# EAGLE design the-why (EAGLE 9.6.2)

## Sheet 1 of 2
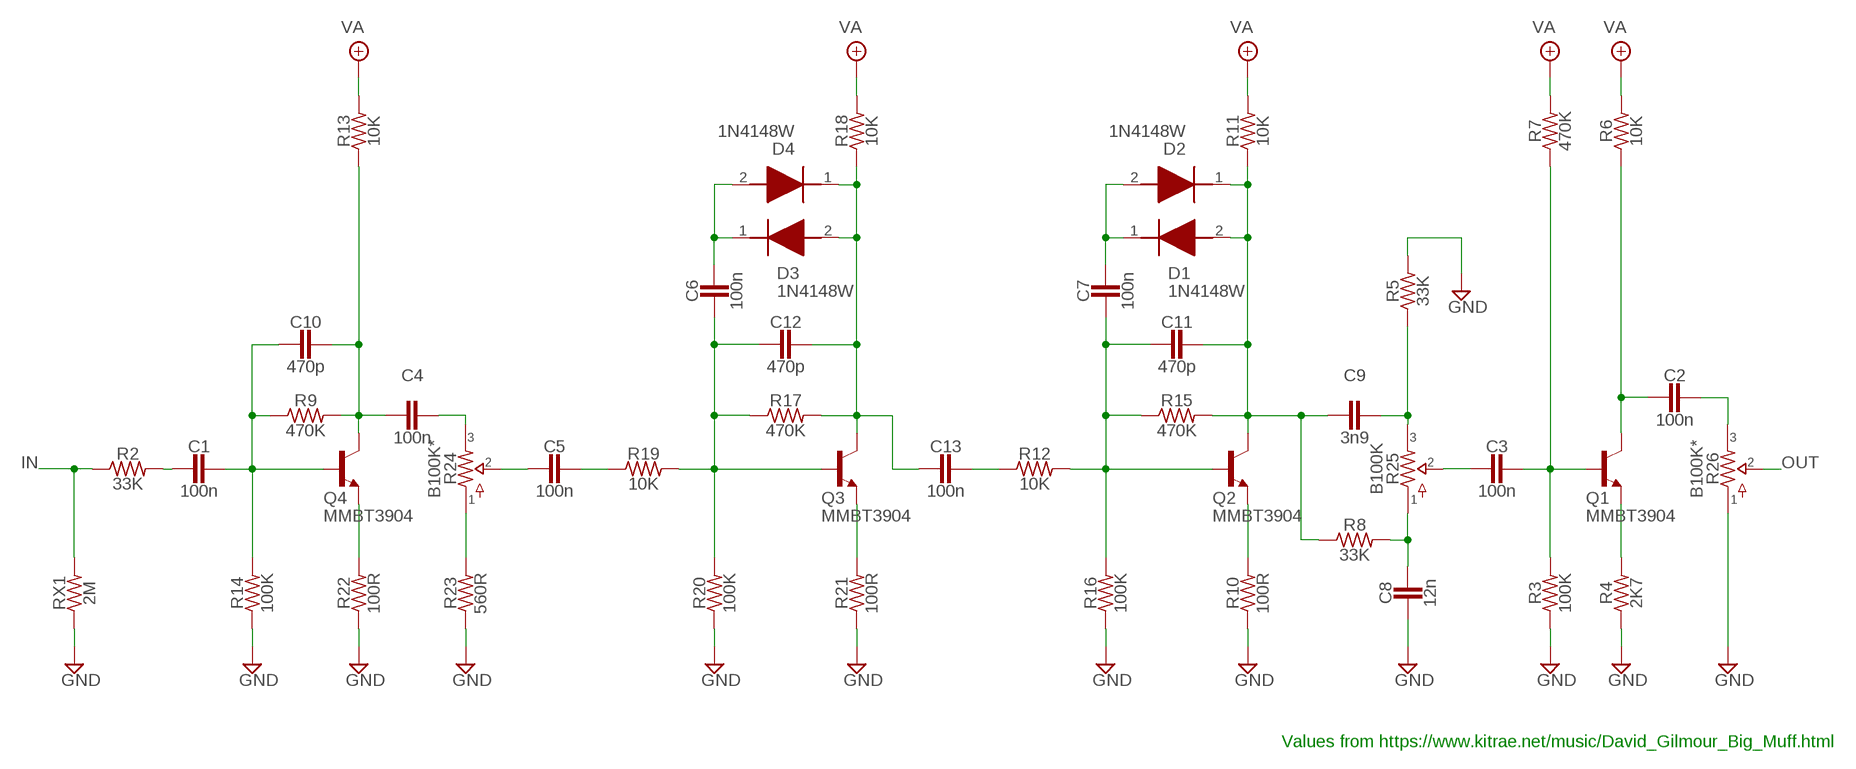
[diagram p0: schematic, sheet 1]

### Parts
C1  100n  CAP1206  [RESISTOR_C1206]
C2  100n  CAP1206  [RESISTOR_C1206]
C3  100n  CAP1206  [RESISTOR_C1206]
C4  100n  CAP1206  [RESISTOR_C1206]
C5  100n  CAP1206  [RESISTOR_C1206]
C6  100n  CAP1206  [RESISTOR_C1206]
C7  100n  CAP1206  [RESISTOR_C1206]
C8  12n  CAP0603  [RESISTOR_R0603]
C9  3n9  CAP1206  [RESISTOR_C1206]
C10  470p  CAP0603  [RESISTOR_R0603]
C11  470p  CAP0603  [RESISTOR_R0603]
C12  470p  CAP0603  [RESISTOR_R0603]
C13  100n  CAP1206  [RESISTOR_C1206]
D1  1N4148W  [SODFL3816X120N]
D2  1N4148W  [SODFL3816X120N]
D3  1N4148W  [SODFL3816X120N]
D4  1N4148W  [SODFL3816X120N]
Q1  MMBT3904  BJTSOT23  [TRANSISTOR_SOT23-BEC]
Q2  MMBT3904  BJTSOT23  [TRANSISTOR_SOT23-BEC]
Q3  MMBT3904  BJTSOT23  [TRANSISTOR_SOT23-BEC]
Q4  MMBT3904  BJTSOT23  [TRANSISTOR_SOT23-BEC]
R2  33K  RESISTOR0603  [RESISTOR_R0603]
R3  100K  RESISTOR0603  [RESISTOR_R0603]
R4  2K7  RESISTOR0603  [RESISTOR_R0603]
R5  33K  RESISTOR0603  [RESISTOR_R0603]
R6  10K  RESISTOR0603  [RESISTOR_R0603]
R7  470K  RESISTOR0603  [RESISTOR_R0603]
R8  33K  RESISTOR0603  [RESISTOR_R0603]
R9  470K  RESISTOR0603  [RESISTOR_R0603]
R10  100R  RESISTOR0603  [RESISTOR_R0603]
R11  10K  RESISTOR0603  [RESISTOR_R0603]
R12  10K  RESISTOR0603  [RESISTOR_R0603]
R13  10K  RESISTOR0603  [RESISTOR_R0603]
R14  100K  RESISTOR0603  [RESISTOR_R0603]
R15  470K  RESISTOR0603  [RESISTOR_R0603]
R16  100K  RESISTOR0603  [RESISTOR_R0603]
R17  470K  RESISTOR0603  [RESISTOR_R0603]
R18  10K  RESISTOR0603  [RESISTOR_R0603]
R19  10K  RESISTOR0603  [RESISTOR_R0603]
R20  100K  RESISTOR0603  [RESISTOR_R0603]
R21  100R  RESISTOR0603  [RESISTOR_R0603]
R22  100R  RESISTOR0603  [RESISTOR_R0603]
R23  560R  RESISTOR0603  [RESISTOR_R0603]
R24  B100K*  16MM.1  [16MM_B.MOUNT]
R25  B100K  16MM.1  [16MM_B.MOUNT]
R26  B100K*  16MM.1  [16MM_B.MOUNT]
RX1  2M  RESISTOR0603  [RESISTOR_R0603]

### Nets
GND: C8.2 R3.1 R4.1 R5.2 R10.1 R14.1 R16.1 R20.1 R21.1 R22.1 R23.1 R26.1 RX1.1 ; also sheet 2
IN: R2.1 RX1.2 ; also sheet 2
N$1: C1.2 R2.2
N$2: C1.1 C10.2 Q4.B R9.1 R14.2
N$3: C4.2 C10.1 Q4.C R9.2 R13.1
N$4: Q4.E R22.2
N$5: C4.1 R24.3
N$6: R23.2 R24.1
N$7: C5.2 R24.2
N$8: C5.1 R19.1
N$9: C6.2 C12.2 Q3.B R17.1 R19.2 R20.2
N$11: C6.1 D3.1(K) D4.2(A)
N$12: Q3.E R21.2
N$13: C9.1 R5.1 R25.3
N$14: C13.1 R12.1
N$15: C7.2 C11.2 Q2.B R12.2 R15.1 R16.2
N$17: Q2.E R10.2
N$18: C7.1 D1.1(K) D2.2(A)
N$19: C8.1 R8.2 R25.1
N$20: C3.2 R25.2
N$21: C3.1 Q1.B R3.2 R7.1
N$22: Q1.E R4.2
N$23: C2.2 Q1.C R6.1
N$24: C2.1 R26.3
N$28: C12.1 C13.2 D3.2(A) D4.1(K) Q3.C R17.2 R18.1
N$29: C9.2 C11.1 D1.2(A) D2.1(K) Q2.C R8.1 R11.1 R15.2
OUT: R26.2 ; also sheet 2
VA: R6.2 R7.2 R11.2 R13.2 R18.2 ; also sheet 2

### Notes on the sheet
- Values from https://www.kitrae.net/music/David_Gilmour_Big_Muff.html

## Sheet 2 of 2
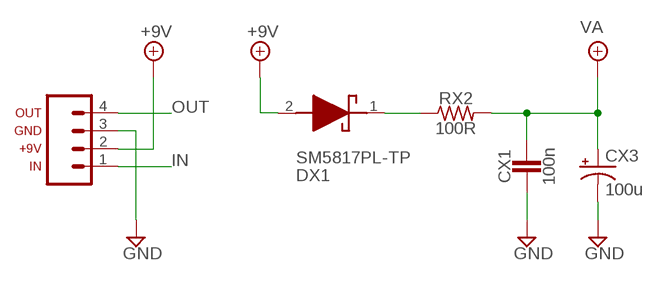
[diagram p1: schematic, sheet 2]

### Parts
CX1  100n  CAP0603  [RESISTOR_R0603]
CX3  100u  0631  [063_025]
DX1  SM5817PL-TP  [SOD3716X120N]
J101  1X04_SMD_STRAIGHT_COMBO  CONN_04PTH  [1X04]
RX2  100R  RESISTOR0603  [RESISTOR_R0603]

### Nets
+9V: DX1.2(A) J101.2(+9V)
GND: CX1.2 CX3.- J101.3(GND) ; also sheet 1
IN: J101.1(IN) ; also sheet 1
N$25: DX1.1(K) RX2.1
OUT: J101.4(OUT) ; also sheet 1
VA: CX1.1 CX3.+ RX2.2 ; also sheet 1

## Library data of the parts
C1-C13 CX1 = the-why:CAP
CX3 = the-why:063: 33 - 220uF Xicon values at Mouser.com 10V: 220uF; 16V: 100uF; 25V: 100uF; 50V: 33uF
D1-D4 = the-why:1N4148W: Rectifier Diode Small Signal Switching 100V 0.15A 4ns 2-Pin SOD-123F T/R Source: Datasheet <https://diotec.com/request/datasheet/1n4148w.pdf>; DESCRIPTION: Rectifier Diode Small Signal Switching 100V 0.15A 4ns 2-Pin SOD-123F T/R; HEIGHT: 1.2mm; MANUFACTURER_NAME: Diotec; MANUFACTURER_PART_NUMBER: 1N4148W; MOUSER_PART_NUMBER: 637-1N4148W; MOUSER_PRICE-STOCK: https://www.mouser.co.uk/ProductDetail/Diotec-Semiconductor/1N4148W?qs=OlC7AqGiEDmsbkbAeXQtXg%3D%3D
DX1 = the-why:SM5817PL-TP: Schottky Barrier Rectifiers Source: Datasheet <https://mccsemi.com/pdf/Products/SM5817PL-SM5819PL(SOD-123FL).pdf>; DESCRIPTION: Schottky Barrier Rectifiers; HEIGHT: 1.2mm; MANUFACTURER_NAME: MCC; MANUFACTURER_PART_NUMBER: SM5817PL-TP; MOUSER_PART_NUMBER: 833-SM5817PL-TP; MOUSER_PRICE-STOCK: https://www.mouser.co.uk/ProductDetail/Micro-Commercial-Components-MCC/SM5817PL-TP?qs=SdqRYZZ9IxAlhPsFLNd53A%3D%3D
J101 = the-why:CONN_04: Multi connection point. Often used as Generic Header-pin footprint for 0.1 inch spaced/style header connections On any of the 0.1 inch spaced packages, you can populate with these: Break Away Headers - Straight <https://www.sparkfun.com/products/116> (PRT-00116) Break Away Male Headers - Right Angle <https://www.sparkfun.com/products/553> (PRT-00553) Female Headers <https://www.sparkfun.com/products/115> (PRT-00115) Break Away Headers - Machine Pin <https://www.sparkfun.com/products/117> (PRT-00117) Break Away Female Headers - Swiss Machine Pin <https://www.sparkfun.com/products/743> (PRT-00743) For SCREWTERMINALS and SPRING TERMINALS visit here: Screw Terimnals on SparkFun.com <https://www.sparkfun.com/search/results?term=Screw+Terminals> (5mm/3.5mm/2.54mm spacing) This device is also useful as a general connection point to wire up your design to another part of your project. Our various solder wires solder well into these plated through hole pads. Hook-Up Wire - Assortment (Stranded, 22 AWG) <https://www.sparkfun.com/products/11375> (PRT-11375) Hook-Up Wire - Assortment (Solid Core, 22 AWG) <https://www.sparkfun.com/products/11367> (PRT-11367) View the entire wire category on our website here <https://www.sparkfun.com/categories/141> Special notes: Molex polarized connector foot print use with SKU : PRT-08231 with associated crimp pins and housings. 1MM SMD Version SKU: PRT-10208; PROD_ID: CONN-14363; SF_ID: PRT-08075; STOREFRONT_SKU: PRT-15900
Q1-Q4 = the-why:BJT
R2-R23 RX1 RX2 = the-why:RESISTOR
R24-R26 = the-why:16MM: 16mm Poteniometers

## Board
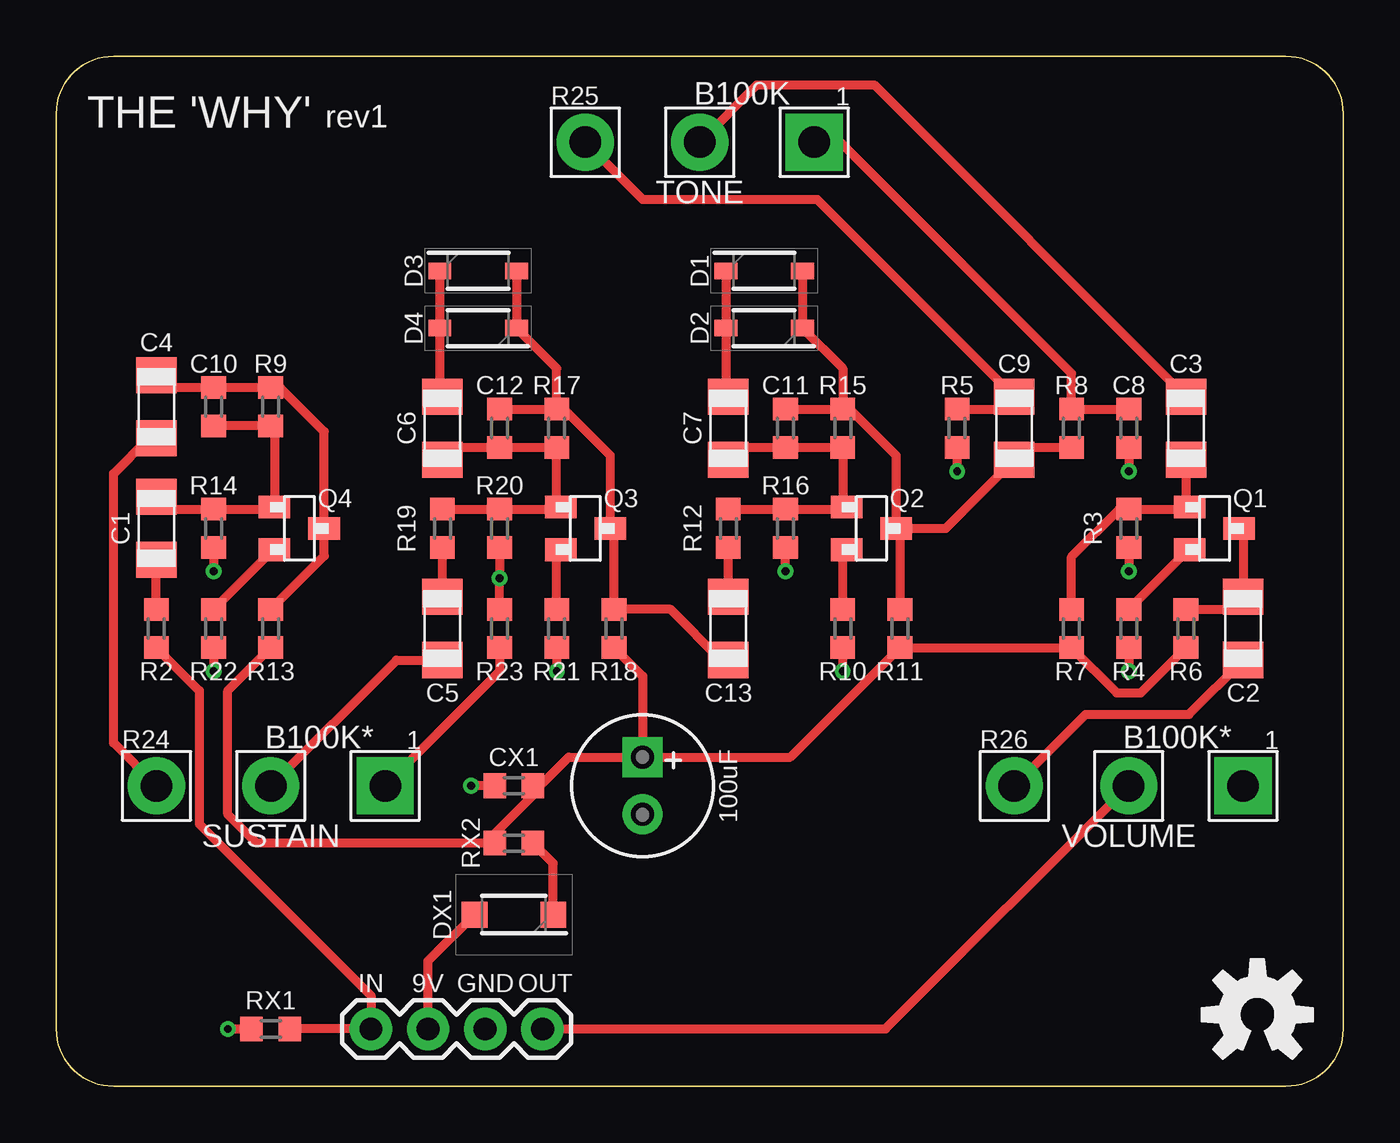
[diagram p2: board, top side]
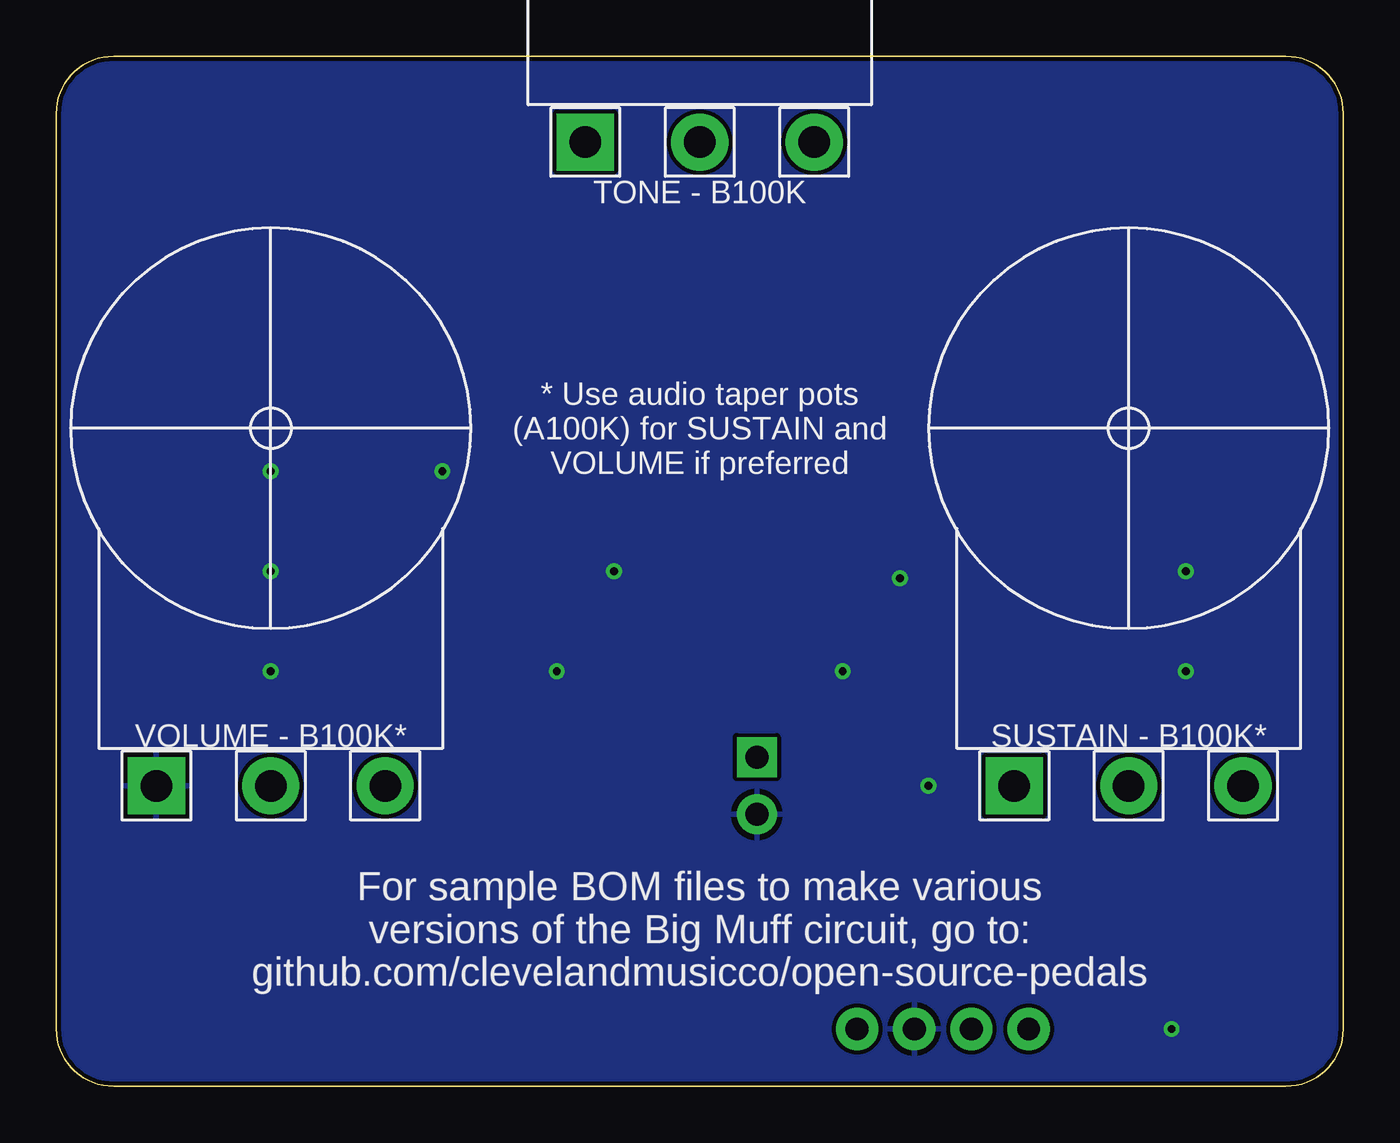
[diagram p3: board, bottom side, seen from below]

Size 57.15 x 45.72 mm. Coordinates in mm from the lower left corner, seen from the top.
Outline: 0,2.54 0,43.18 arc-90 2.54,45.72 54.61,45.72 arc-90 57.15,43.18 57.15,2.54 arc-90 54.61,0 2.54,0 arc-90 0,2.54
Copper layers (1*16): Top 0.035mm / dielectric 1.5mm / Bottom 0.035mm
Design rules "SparkFun-2-Layer-General-JLCPCB": minimum track width 7mil, minimum drill 0.3mm, track to track 7mil, track to pad 7mil, pad to pad 7mil, via to via 7mil, smd to smd 7mil, copper to edge 7mil, drill to drill 7mil, minimum pad ring 7mil, minimum via ring 7mil, stop-mask expansion 3mil, vias tented up to drill 25mil, thermal gap 10mil

### Footprints (pad centres in the part's own frame; a part is rotated, then mirrored left to right if it is on the bottom)
RESISTOR_C1206 = smd 1.6 x 1.8: 1 -1.4,0; 2 1.4,0
RESISTOR_R0603 = smd 1 x 1.1: 1 -0.85,0; 2 0.85,0
063_025 = drill 1.016 pad 1.778 square: + -1.27,0 | drill 1.016 pad 1.778: - 1.27,0
SODFL3816X120N = smd 1.02 x 0.74: 1 -1.7,0; 2 1.7,0
SOD3716X120N = smd 1.15 x 1.15: 1 -1.75,0; 2 1.75,0
1X04 = drill 1.016 pad 1.88: 1 0,0; 2 2.54,0; 3 5.08,0; 4 7.62,0
TRANSISTOR_SOT23-BEC = smd 1 x 1.4: B -0.95,-1.1; C 0,1.1; E 0.95,-1.1
16MM_B.MOUNT = drill 1.4 pad 2.54 square: 1 5.08,0 | drill 1.4 pad 2.54: 2 0,0; 3 -5.08,0

### Placement (x,y rotation side)
C1  4.45,24.77 270 top
C2  52.7,20.32 90 top
C3  50.16,29.21 90 top
C4  4.45,30.16 90 top
C5  17.14,20.32 270 top
C6  17.14,29.21 270 top
C7  29.84,29.21 270 top
C8  47.62,29.21 270 top
C9  42.55,29.21 270 top
C10  6.99,30.16 270 top
C11  32.38,29.21 270 top
C12  19.68,29.21 270 top
C13  29.84,20.32 270 top
CX1  20.32,13.34 180 top
CX3  26.04,13.34 270 top
D1  31.43,36.2 0 top
D2  31.43,33.66 180 top
D3  18.73,36.2 0 top
D4  18.73,33.66 180 top
DX1  20.32,7.62 180 top
J101  13.97,2.54 0 top
Q1  51.44,24.77 270 top
Q2  36.2,24.77 270 top
Q3  23.5,24.77 270 top
Q4  10.79,24.77 270 top
R2  4.45,20.32 90 top
R3  47.62,24.77 90 top
R4  47.62,20.32 90 top
R5  40.01,29.21 270 top
R6  50.16,20.32 270 top
R7  45.09,20.32 270 top
R8  45.09,29.21 90 top
R9  9.53,30.16 90 top
R10  34.92,20.32 90 top
R11  37.47,20.32 270 top
R12  29.84,24.77 90 top
R13  9.53,20.32 270 top
R14  6.99,24.77 90 top
R15  34.92,29.21 90 top
R16  32.38,24.77 90 top
R17  22.23,29.21 90 top
R18  24.77,20.32 270 top
R19  17.14,24.77 90 top
R20  19.68,24.77 90 top
R21  22.23,20.32 90 top
R22  6.99,20.32 90 top
R23  19.68,20.32 270 top
R24  9.53,13.34 0 top
R25  28.57,41.91 0 top
R26  47.62,13.34 0 top
RX1  9.53,2.54 0 top
RX2  20.32,10.79 180 top
U$1  [125B_BOARD]  0,0 0 top
U$2  [OSHW-LOGO-M]  53.34,3.17 0 top

### Tracks (layer width: path | path; a pad name or v marks a point on that pad's centre or on a via)
+9V
  Top 0.406: J101.2 16.51,5.56 DX1.2
GND  (via drill 0.35)
  Top 0.406: R14.1 v6.99,22.86 | R22.1 v6.99,18.41 | R20.1 v19.68,22.54 R23.1 | R21.1 v22.23,18.41 | v32.38,22.86 R16.1 | v34.92,18.41 R10.1 | R5.2 v40.01,27.3 | C8.2 v47.62,27.3 | R3.1 v47.62,22.86 | R4.1 v47.62,18.41 | CX1.2 v18.41,13.34 | v7.62,2.54 RX1.1
  pour Bottom: 0,18.41 0,43.18 arc-90 2.54,45.72 37.47,45.72 54.61,45.72 arc-90 57.15,43.18 57.15,20.32 57.15,2.54 arc-90 54.61,0 22.86,0 2.54,0 arc-90 0,2.54
IN
  Top 0.406: R2.1 6.35,17.57 6.35,11.64 13.97,4.03 J101.1 RX1.2
N$1
  Top 0.406: R2.2 C1.2
N$2
  Top 0.406: C1.1 4.53,26.16 5.08,25.61 R14.2 9.6,25.61 Q4.B 9.7,29.14 R9.1 C10.2
N$3
  Top 0.406: C4.2 4.45,31.33 4.76,31.01 C10.1 R9.2 9.95,31.01 11.89,29.06 Q4.C 11.89,23.54 R13.1
N$4
  Top 0.406: Q4.E 9.63,23.82 R22.2
N$5
  Top 0.406: R24.3 2.54,15.24 2.54,27.19 4.11,28.76 C4.1
N$6
  Top 0.406: R23.2 19.68,18.41 R24.1
N$7
  Top 0.406: R24.2 15.11,18.92 C5.2
N$8
  Top 0.406: C5.1 R19.1
N$9
  Top 0.406: R19.2 R20.2 22.3,25.61 Q3.B 22.23,25.89 R17.1 C12.2 17.7,28.36 C6.2
N$11
  Top 0.406: D3.1 D4.2 17.03,30.72 C6.1
N$12
  Top 0.406: R21.2 22.23,23.64 Q3.E
N$13
  Top 0.406: R25.3 26.04,39.37 33.78,39.37 C9.1 41.99,30.06 R5.1
N$14
  Top 0.406: C13.1 R12.1
N$15
  Top 0.406: R12.2 R16.2 34.92,25.61 | 34.92,25.61 34.99,25.61 Q2.B | 34.92,25.61 R15.1 C11.2 30.39,28.36 C7.2
N$17
  Top 0.406: R10.2 34.92,23.64 Q2.E
N$18
  Top 0.406: D1.1 D2.2 29.73,30.72 C7.1
N$19
  Top 0.406: C8.1 R8.2 45.09,31.65 34.82,41.91 R25.1
N$20
  Top 0.406: R25.2 31.11,44.45 36.33,44.45 C3.2
N$21
  Top 0.406: C3.1 50.16,25.89 Q1.B 50.23,25.61 R3.2 47.2,25.61 45.09,23.5 R7.1
N$22
  Top 0.406: R4.2 50.27,23.82 Q1.E
N$23
  Top 0.406: Q1.C 52.7,24.59 C2.2 52.16,21.17 R6.1
N$24
  Top 0.406: C2.1 50.3,16.51 45.72,16.51 R26.3
N$25
  Top 0.406: DX1.1 22.07,9.89 RX2.1
N$28
  Top 0.406: C12.1 R17.2 | R17.2 22.23,31.86 D4.1 D3.2 | R17.2 22.54,30.06 24.59,28.01 Q3.C 24.77,24.59 R18.1 27.28,21.17 29.53,18.92 C13.2
N$29
  Top 0.406: D1.2 D2.1 34.92,31.86 R15.2 | Q2.C 37.47,24.59 R11.1 | C11.1 R15.2 | R15.2 35.24,30.06 37.3,28.01 Q2.C | R8.1 43.09,28.36 C9.2 39.5,24.77 Q2.C
OUT
  Top 0.406: J101.4 36.83,2.54 R26.2
VA
  Top 0.406: R6.2 48.16,17.46 47.09,17.46 R7.2 R11.2 32.6,14.61 CX3.+ | R13.2 7.62,17.57 7.62,12.06 8.89,10.79 RX2.2 19.47,11.21 21.17,12.91 CX1.1 21.49,13.34 22.76,14.61 CX3.+ | R18.2 26.04,18.2 CX3.+

### Text on the board
tPlace: THE 'WHY' | rev1 | TONE | 100uF | SUSTAIN | VOLUME
bNames: TONE - B100K | * Use audio taper pots / (A100K) for SUSTAIN and / VOLUME if preferred | SUSTAIN - B100K* | VOLUME - B100K* | For sample BOM files to make various / versions of the Big Muff circuit, go to: / github.com/clevelandmusicco/open-source-pedals